# Altium project esp8266sensor.PrjPcb
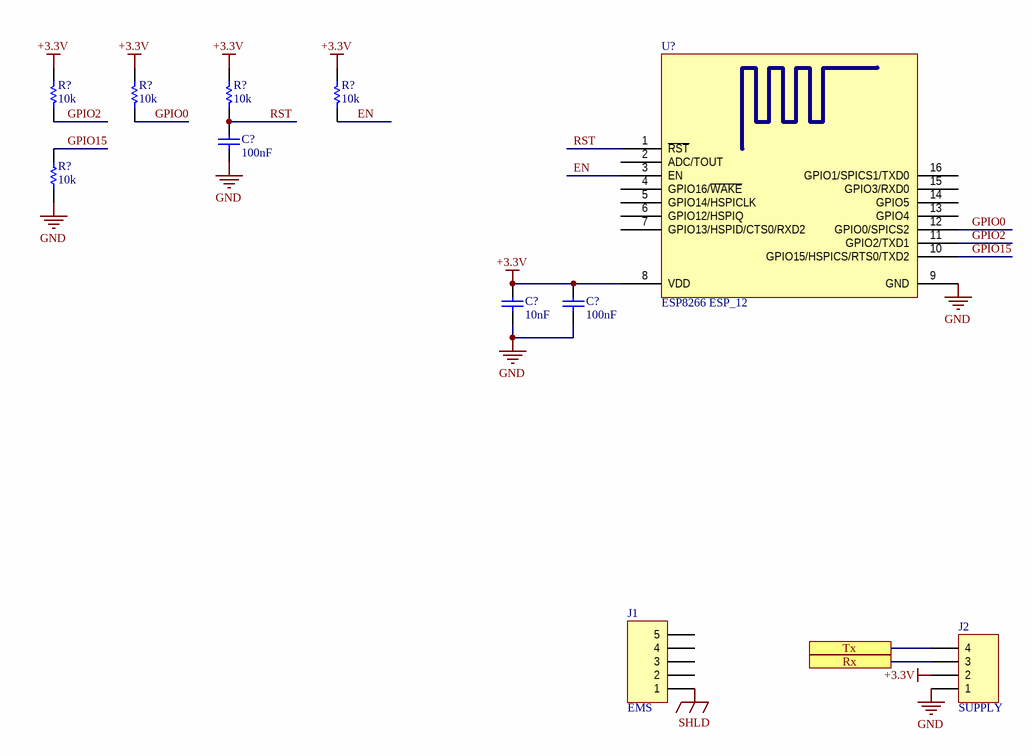
[diagram p0: esp8266sensor.SchDoc]
prj_date: None - [01/01/2000]; prj_hw_ver: None - [0, 1, 2, 3, ...]; prj_license: None - [GPL, LGPL, MIT, ...]; prj_name: None - [PROJECT NAME]; prj_name_long: None - [PROJECT NAME LONG]; prj_pcb: None - [A, B, C, D, ...]; prj_pn: None - [P/N, S/N, ...]; prj_status: None - [Product, Prototype]
1 sheet, 11 parts. Net scope: flat (ports and power ports of the same name join across sheets).
Board file: esp8266sensor.PcbDoc

## Sheet esp8266sensor.SchDoc: TITLE
size A3; Author: AUTHOR; Organization: Develer s.r.l.; Address1: via Mugellese 1/A; Address2: 50019 Campi Bisenzio; Address3: Firenze; Address4: ITALY; Revision: A; SheetNumber: 1; SheetTotal: 1; Hw_rev: R1

### Parts
(Parts that share a designator on the sheet are numbered #1, #2 ... from top to bottom, then left to right.)
C?#1  100nF  [0603_[1608]]
C?#2  10nF  [0603_[1608]]
C?#3  100nF  [0603_[1608]]
J1  EMS  [CON_5P_WAGO_2.5MM]
J2  SUPPLY  [CON_4P_WAGO_2.5MM]
R?#1  10k  [0603_[1608]]
R?#2  10k  [0603_[1608]]
R?#3  10k  [0603_[1608]]
R?#4  10k  [0603_[1608]]
R?#5  10k  [0603_[1608]]
U?  ESP8266 ESP_12  [ESP8266 ESP_12]

### Ports
Rx, Tx

### Nets
+3.3V: C?#2.2 C?#3.2 J2.2 R?#1.2 R?#2.2 R?#3.2 R?#4.2 U?.8(VDD)
GND: C?#1.1 C?#2.1 C?#3.1 J2.1 R?#5.2 U?.9(GND)
SHLD: J1.1
EN: R?#4.1 U?.3(EN)
GPIO0: R?#2.1 U?.12(GPIO0/SPICS2)
GPIO2: R?#1.1 U?.11(GPIO2/TXD1)
GPIO15: R?#5.1 U?.10(GPIO15/HSPICS/RTS0/TXD2)
RST: C?#1.2 R?#3.1 U?.1(~{RST})
Rx: J2.3 ; port Rx
Tx: J2.4 ; port Tx

Not connected (* = marked no-connect by the designer): J1 2 3 4 5; U? 2(ADC/TOUT) 4(GPIO16/~{WAKE}) 5(GPIO14/HSPICLK) 6(GPIO12/HSPIQ) 7(GPIO13/HSPID/CTS0/RXD2) 13(GPIO4) 14(GPIO5) 15(GPIO3/RXD0) 16(GPIO1/SPICS1/TXD0)

### Notes on the sheet
- Title:
- Project:
- Status:
- Author:
- License:
- Rev:
- Size:
- A3
- File:
- Date:
- Time:
- Sheet
- of

### Library data of the parts
C?#1-C?#3 = Cap: Ceramic X7R 50V; Value: 100pF; Published: 8-Jun-2000; LatestRevisionDate: 17-Jul-2002; LatestRevisionNote: Re-released for DXP Platform.; PackageReference: RAD-0.3; Publisher: Altium Limited; PackageDescription: Radial Cap, Thru-Hole; 2 Leads; 0.3 in Pin Spacing
J1 = Header 5: Header, 5-Pin; LatestRevisionDate: 17-Jul-2002; LatestRevisionNote: Re-released for DXP Platform.; Publisher: Altium Limited
J2 = Header 4: Header, 4-Pin; LatestRevisionDate: 17-Jul-2002; LatestRevisionNote: Re-released for DXP Platform.; Publisher: Altium Limited
R?#1-R?#5 = Res1: Resistor; Value: 1K; Published: 8-Jun-2000; Revision: July-2002: Re-released for DXP Platform.; Publisher: Altium Limited
U? = ESP8266 ESP_12: ESP8266 ESP-12; IC: ESP8266-EX; Vendor: Ai-thinker; LatestReviewer: Zion Blue; Published: 14-Apr-2015; Publisher: Cynetik Group; LatestRevisionData: 14-Apr-2015; LatestRevisionNote: Include 3D body and Footprint